# EAGLE design amp-7 (EAGLE 8.6.0)
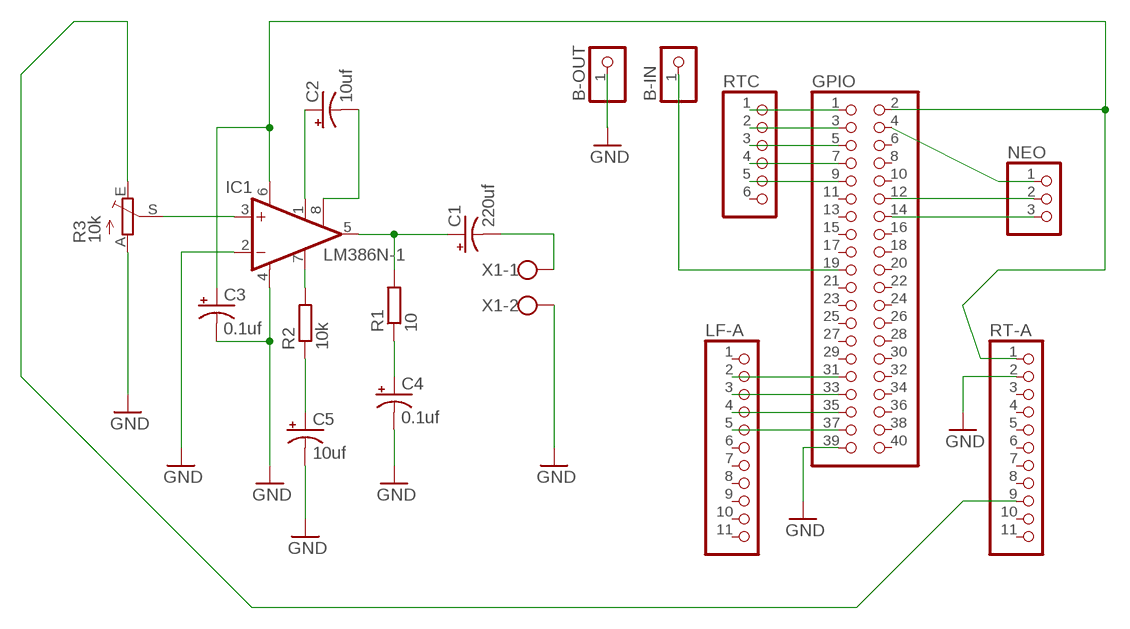
[diagram p0: schematic, sheet 1]

## Parts
B-IN  PINHD-1X1  [1X01]
B-OUT  PINHD-1X1  [1X01]
C1  220uf  CPOL-USE2-5  [E2-5]
C2  10uf  CPOL-USE2-4  [E2-4]
C3  0.1uf  CPOL-USE2-4  [E2-4]
C4  0.1uf  CPOL-USE2-4  [E2-4]
C5  10uf  CPOL-USE2-4  [E2-4]
GPIO  PINHD-2X20  [2X20]
IC1  LM386N-1  [DIL08]
LF-A  HEADER-1X1176MIL  [1X11_ROUND_76]
NEO  PINHD-1X3  [1X03]
R1  10  R0204/7  [0204/7]
R2  10k  R0204/7  [0204/7]
R3  10k  TRIM_EU-LI10  [LI10]
RT-A  HEADER-1X1176MIL  [1X11_ROUND_76]
RTC  PINHD-1X6  [1X06]
X1  W237-102  [W237-102]

## Nets
5V: C3.+ GPIO.2 IC1.6(VS) RT-A.1
AUDIO-DATA: R3.E RT-A.9
DATA: GPIO.12 NEO.2
GND: B-OUT.1 C3.- C4.- C5.- GPIO.39 IC1.2(-IN) IC1.4(GND) R3.A RT-A.2 X1.2
GND3: GPIO.14 NEO.3
N$1: IC1.3(+IN) R3.S
N$2: C4.+ R1.1
N$3: IC1.7(BYPASS) R2.2
N$4: C2.+ IC1.1(GAIN)
N$5: C2.- IC1.8(GAIN)
N$6: C1.+ IC1.5(OUT) R1.2
N$7: C1.- X1.1
N$8: C5.+ R2.1
N$9: GPIO.31 LF-A.2
N$10: GPIO.33 LF-A.3
N$11: GPIO.35 LF-A.4
N$12: GPIO.37 LF-A.5
N$13: GPIO.1 RTC.1
N$14: GPIO.3 RTC.2
N$15: B-IN.1 GPIO.19
N$16: GPIO.5 RTC.3
N$17: GPIO.7 RTC.4
N$18: GPIO.9 RTC.5
POWER: GPIO.4 NEO.1
Unconnected: GPIO.6 GPIO.8 GPIO.10 GPIO.11 GPIO.13 GPIO.15 GPIO.16 GPIO.17 GPIO.18 GPIO.20 GPIO.21 GPIO.22 GPIO.23 GPIO.24 GPIO.25 GPIO.26 GPIO.27 GPIO.28 GPIO.29 GPIO.30 GPIO.32 GPIO.34 GPIO.36 GPIO.38 GPIO.40 LF-A.1 LF-A.6 LF-A.7 LF-A.8 LF-A.9 LF-A.10 LF-A.11 RT-A.3 RT-A.4 RT-A.5 RT-A.6 RT-A.7 RT-A.8 RT-A.10 RT-A.11 RTC.6

## Library data of the parts
B-IN B-OUT = adafruit:PINHD-1X1: Pin header 1x1 for 0.1" spacing With round pins
C1-C5 = adafruit:CPOL-US: POLARIZED CAPACITOR, American symbol
GPIO = adafruit:PINHD-2X20: PIN HEADER
IC1 = linear:LM386?-*: Low Voltage Audio Power Amplifier Source: http://cache.national.com/ds/LM/LM386.pdf
LF-A RT-A = microbuilder:HEADER-1X11
NEO = adafruit:PINHD-1X3: PIN HEADER
R1 R2 = eagle-ltspice:R: RESISTOR, European symbol; SPICEMODEL: NONE; SPICEPREFIX: R
R3 = pot:TRIM_EU-: POTENTIOMETER
RTC = adafruit:PINHD-1X6: PIN HEADER
X1 = con-wago-500:W237-102: WAGO SCREW CLAMP; MPN: 237-102; OC_FARNELL: unknown; OC_NEWARK: 70K9898

## Board
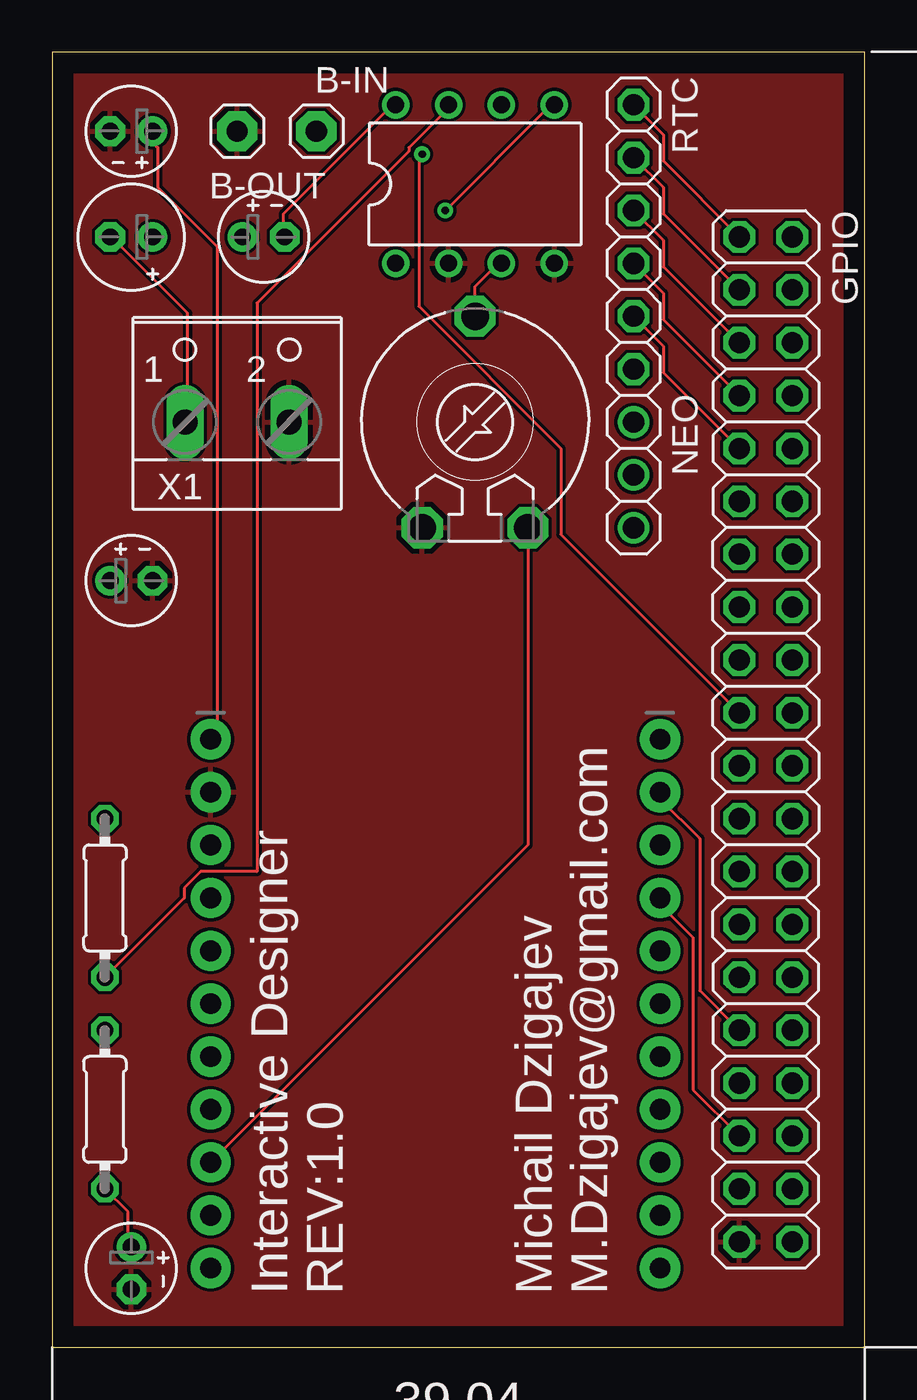
[diagram p1: board, top side]
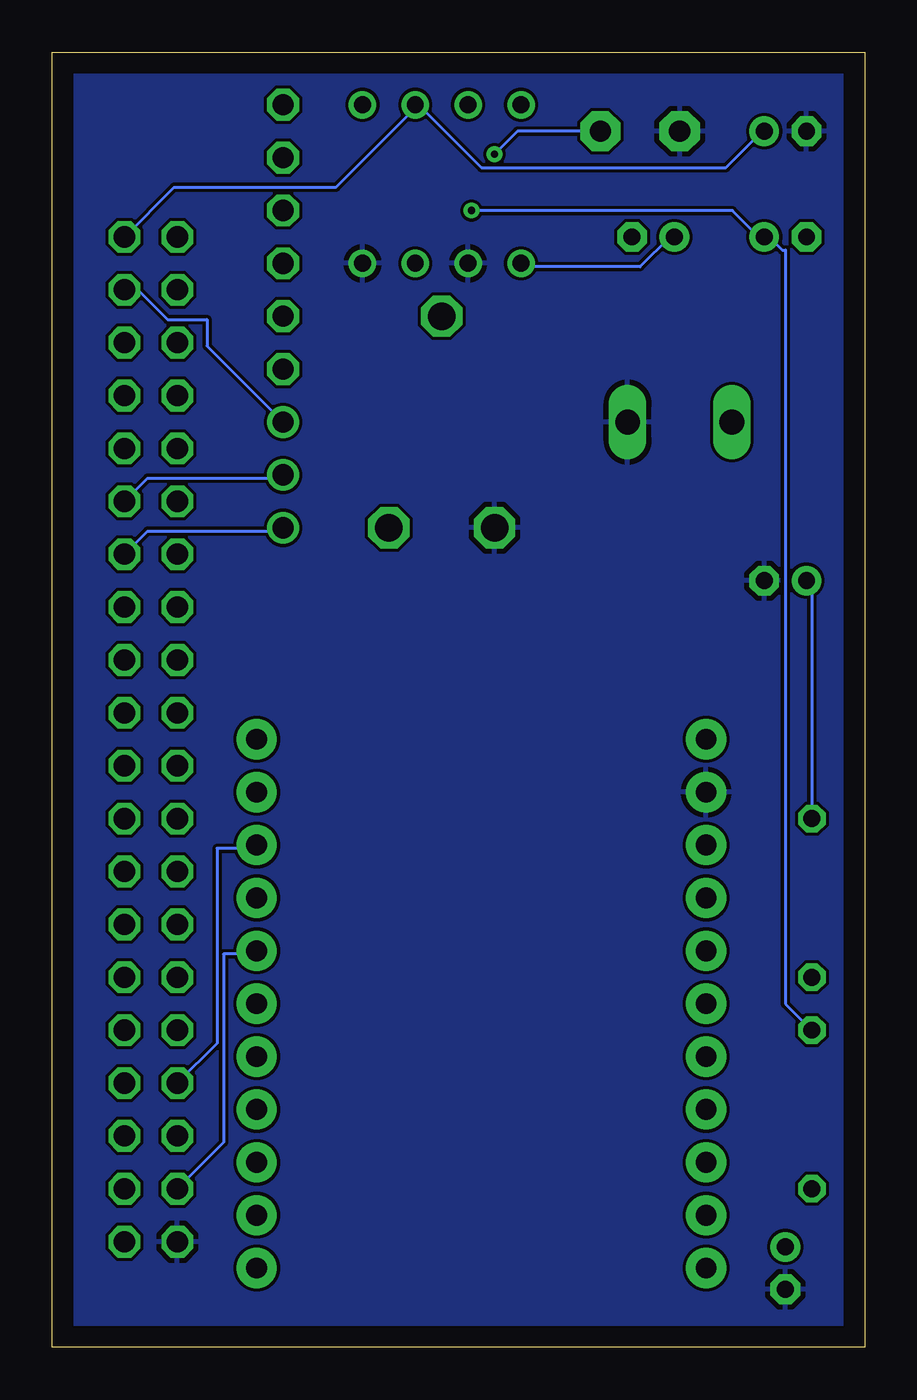
[diagram p2: board, bottom side, seen from below]

Size 39.04 x 62.22 mm. Coordinates in mm from the lower left corner, seen from the top.
Outline: 0,0 39.04,0 39.04,62.22 0,62.22 0,0
Copper layers (1*16): Top 0.035mm / dielectric 1.5mm / Bottom 0.035mm
Design rules "default": minimum track width 6mil, minimum drill 0.35mm, track to track 6mil, track to pad 6mil, pad to pad 6mil, via to via 6mil, smd to smd 6mil, copper to edge 40mil, drill to drill 6mil, minimum pad ring 10mil, minimum via ring 8mil, stop-mask expansion 4mil, vias tented up to drill 0mil, thermal gap 10mil

### Footprints (pad centres in the part's own frame; a part is rotated, then mirrored left to right if it is on the bottom)
1X01 = drill 1.016 pad 1.93 octagon: 1 0,0
E2-5 = drill 0.813 pad 1.422: + -1.016,0 | drill 0.813 pad 1.422 octagon: - 1.016,0
E2-4 = drill 0.813 pad 1.422: + -1.016,0 | drill 0.813 pad 1.422 octagon: - 1.016,0
2X20 = drill 1.016 octagon: 1 -24.13,-1.27; 2 -24.13,1.27; 3 -21.59,-1.27; 4 -21.59,1.27; 5 -19.05,-1.27; 6 -19.05,1.27; 7 -16.51,-1.27; 8 -16.51,1.27; 9 -13.97,-1.27; 10 -13.97,1.27; 11 -11.43,-1.27; 12 -11.43,1.27; 13 -8.89,-1.27; 14 -8.89,1.27; 15 -6.35,-1.27; 16 -6.35,1.27; 17 -3.81,-1.27; 18 -3.81,1.27; 19 -1.27,-1.27; 20 -1.27,1.27; 21 1.27,-1.27; 22 1.27,1.27; 23 3.81,-1.27; 24 3.81,1.27; 25 6.35,-1.27; 26 6.35,1.27; 27 8.89,-1.27; 28 8.89,1.27; 29 11.43,-1.27; 30 11.43,1.27; 31 13.97,-1.27; 32 13.97,1.27; 33 16.51,-1.27; 34 16.51,1.27; 35 19.05,-1.27; 36 19.05,1.27; 37 21.59,-1.27; 38 21.59,1.27; 39 24.13,-1.27; 40 24.13,1.27
DIL08 = drill 0.813 pad 1.27: 1 -3.81,-3.81; 2 -1.27,-3.81; 3 1.27,-3.81; 4 3.81,-3.81; 5 3.81,3.81; 6 1.27,3.81; 7 -1.27,3.81; 8 -3.81,3.81
1X11_ROUND_76 = drill 1 pad 1.93: 1 -12.7,0; 2 -10.16,0; 3 -7.62,0; 4 -5.08,0; 5 -2.54,0; 6 0,0; 7 2.54,0; 8 5.08,0; 9 7.62,0; 10 10.16,0; 11 12.7,0
1X03 = drill 1.016: 1 -2.54,0; 2 0,0; 3 2.54,0
0204/7 = drill 0.813 octagon: 1 -3.81,0; 2 3.81,0
LI10 = drill 1.321 octagon: A -2.54,-5.08; E 2.54,-5.08; S 0,5.08
1X06 = drill 1.016 octagon: 1 -6.35,0; 2 -3.81,0; 3 -1.27,0; 4 1.27,0; 5 3.81,0; 6 6.35,0
W237-102 = drill 1.194 long: 1 -2.5,-1.27; 2 2.5,-1.27

### Placement (x,y rotation side)
B-IN  12.7,58.42 0 top
B-OUT  8.89,58.42 0 top
C1  3.81,53.34 180 top
C2  10.16,53.34 0 top
C3  3.81,58.42 180 top
C4  3.81,3.81 270 top
C5  3.81,36.83 0 top
GPIO  34.29,29.21 270 top
IC1  20.32,55.88 0 top
LF-A  29.21,16.51 270 top
NEO  27.94,41.91 270 top
R1  2.54,11.43 90 top
R2  2.54,21.59 270 top
R3  20.32,44.45 0 top
RT-A  7.62,16.51 270 top
RTC  27.94,53.34 270 top
X1  8.89,45.72 0 top

### Tracks (layer width: path | path; a pad name or v marks a point on that pad's centre or on a via)
5V
  Top 0.152: RT-A.1 7.94,29.53 7.94,52.86 5.08,55.72 5.08,57.63 4.92,57.78 4.92,58.42 C3.+
  Bottom 0.152: 21.59,59.37 21.59,59.21 21.91,59.21 25.4,55.72 33.18,55.72 GPIO.2 | 21.59,59.37 21.11,59.37 18.41,56.67 6.67,56.67 4.92,58.42 C3.+ | 21.59,59.37 IC1.6
AUDIO-DATA
  Top 0.152: RT-A.9 22.86,24.13 R3.E
DATA
  Bottom 0.152: NEO.2 28.1,41.75 34.45,41.75 GPIO.12
GND
  pour Top: -2.54,-2.54 -2.54,63.5 41.91,63.5 41.91,-2.54
  pour Bottom: -3.81,64.77 43.18,64.77 43.18,-3.81 -3.81,-3.81
GND3
  Bottom 0.152: NEO.3 28.1,39.21 34.45,39.21 GPIO.14
N$1
  Top 0.152: IC1.3 21.11,52.07 21.11,51.75 20.32,50.96 R3.S
N$2
  Top 0.152: R1.1 3.65,6.51 3.65,5.08 3.81,4.92 C4.+
N$3
  Top 0.152: R2.2 6.35,21.59 6.35,22.07 7.14,22.86 9.84,22.86 9.84,50.16 17.14,57.47 17.14,57.63 19.05,59.53 IC1.7
N$4
  Bottom 0.152: IC1.1 16.35,51.91 10.79,51.91 9.37,53.34 C2.+
N$5
  Top 0.152: IC1.8 16.03,59.69 16.03,59.37 11.11,54.45 11.11,53.34 C2.-
N$6  (via drill 0.35)
  Top 0.152: IC1.5 23.65,59.69 23.65,59.37 v18.89,54.61
  Bottom 0.152: R1.2 3.81,16.51 3.81,52.7 3.97,52.7 4.6,53.34 C1.+ 5.08,53.34 6.35,54.61 v18.89,54.61
N$7
  Top 0.152: C1.- 2.86,53.34 6.51,49.69 6.51,44.45 X1.1
N$8
  Bottom 0.152: R2.1 2.54,36.83 C5.+
N$9
  Top 0.152: GPIO.31 31.11,17.14 31.11,24.45 29.21,26.35 LF-A.2
N$10
  Bottom 0.152: GPIO.33 31.11,14.61 31.11,23.97 29.37,23.97 LF-A.3
N$11
  Top 0.152: GPIO.35 30.8,12.38 30.8,19.68 29.21,21.27 LF-A.4
N$12
  Bottom 0.152: GPIO.37 30.8,9.84 30.8,18.89 29.37,18.89 LF-A.5
N$13
  Top 0.152: GPIO.1 29.37,56.99 29.37,58.26 RTC.1
N$14
  Top 0.152: GPIO.3 29.37,54.45 29.37,55.72 RTC.2
N$15  (via drill 0.35)
  Top 0.152: GPIO.19 24.45,39.05 24.45,43.18 17.62,50.01 17.62,57.15 v17.78,57.31
  Bottom 0.152: v17.78,57.31 16.67,58.42 B-IN.1
N$16
  Top 0.152: GPIO.5 29.37,51.91 29.37,53.18 RTC.3
N$17
  Top 0.152: GPIO.7 29.37,49.37 29.37,50.64 RTC.4
N$18
  Top 0.152: GPIO.9 29.37,46.83 29.37,48.1 RTC.5
POWER
  Bottom 0.152: NEO.1 31.59,48.1 31.59,49.37 33.5,49.37 34.93,50.8 GPIO.4

### Text on the board
tPlace: Interactive Designer / REV:1.0 | Michail Dzigajev / M.Dzigajev@gmail.com